# Altium schematic sheet Full-Bridge Converter.SchDoc: Schematic
size A3; DocumentNumber: 1; SheetNumber: 1; SheetTotal: 2
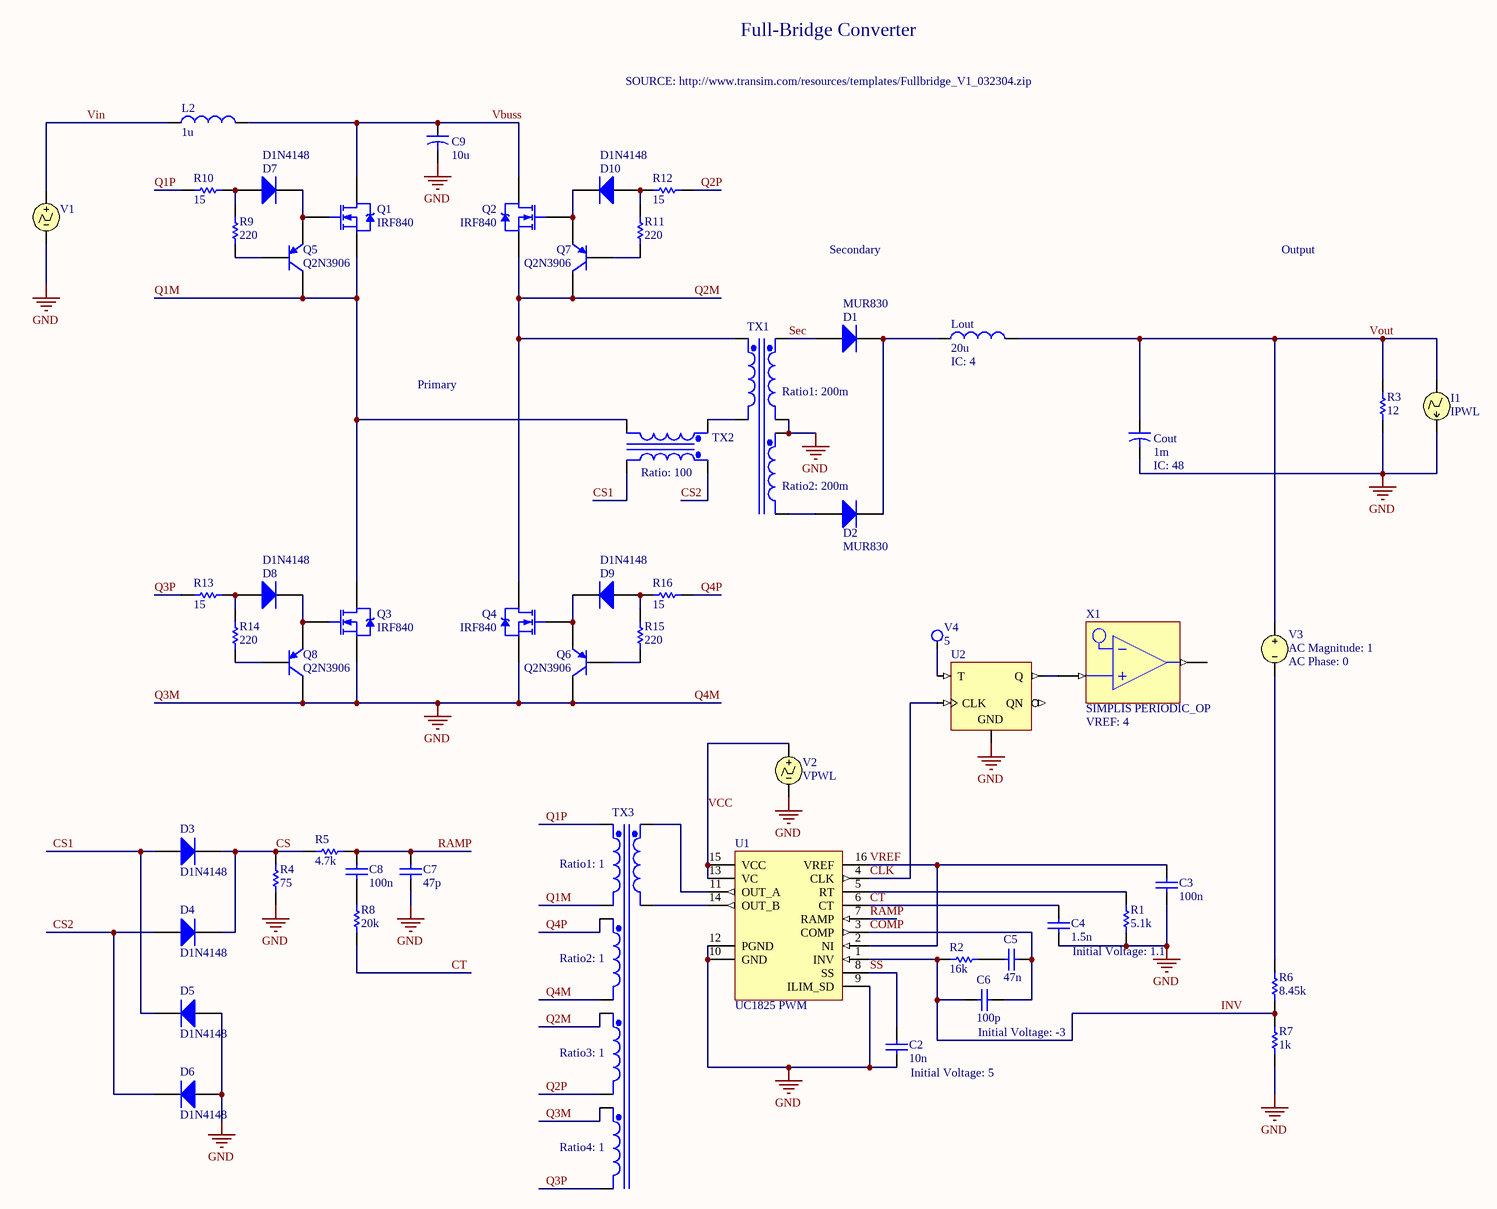
[diagram p0: Full-Bridge Converter.SchDoc]

## Parts
C2  value 10n  Initial Voltage: 5  [RAD-0.3]  (hidden comment: Cap)
C3  value 100n  [RAD-0.3]  (hidden comment: Cap)
C4  value 1.5n  Initial Voltage: 1.1  [RAD-0.3]  (hidden comment: Cap)
C5  value 47n  [RAD-0.3]  (hidden comment: Cap)
C6  value 100p  Initial Voltage: -3  [RAD-0.3]  (hidden comment: Cap)
C7  value 47p  [RAD-0.3]  (hidden comment: Cap)
C8  value 100n  [RAD-0.3]  (hidden comment: Cap)
C9  CC: 10u  [CAPR5-4X5]  (hidden comment: Cap Elec (L1-3))
Cout  IC: 48  CC: 1m  [CAPR5-4X5]  (hidden comment: Cap Elec (L1-3))
D1  MUR830  [SMC]
D2  MUR830  [SMC]
D3  D1N4148  [DO-35]
D4  D1N4148  [DO-35]
D5  D1N4148  [DO-35]
D6  D1N4148  [DO-35]
D7  D1N4148  [DO-35]
D8  D1N4148  [DO-35]
D9  D1N4148  [DO-35]
D10  D1N4148  [DO-35]
I1  IPWL  [HDR1X2H]
L2  value 1u  [0402-A]  (hidden comment: Lossy Inductor)
Lout  value 20u  IC: 4  [0402-A]  (hidden comment: Lossy Inductor)
Q1  IRF840  [TO-220AB]
Q2  IRF840  [TO-220AB]
Q3  IRF840  [TO-220AB]
Q4  IRF840  [TO-220AB]
Q5  Q2N3906  [TO-92A]
Q6  Q2N3906  [TO-92A]
Q7  Q2N3906  [TO-92A]
Q8  Q2N3906  [TO-92A]
R1  value 5.1k  [AXIAL-0.3]  (hidden comment: Res1)
R2  value 16k  [AXIAL-0.3]  (hidden comment: Res1)
R3  value 12  [AXIAL-0.3]  (hidden comment: Res1)
R4  value 75  [AXIAL-0.3]  (hidden comment: Res1)
R5  value 4.7k  [AXIAL-0.3]  (hidden comment: Res1)
R6  value 8.45k  [AXIAL-0.3]  (hidden comment: Res1)
R7  value 1k  [AXIAL-0.3]  (hidden comment: Res1)
R8  value 20k  [AXIAL-0.3]  (hidden comment: Res1)
R9  value 220  [AXIAL-0.3]  (hidden comment: Res1)
R10  value 15  [AXIAL-0.3]  (hidden comment: Res1)
R11  value 220  [AXIAL-0.3]  (hidden comment: Res1)
R12  value 15  [AXIAL-0.3]  (hidden comment: Res1)
R13  value 15  [AXIAL-0.3]  (hidden comment: Res1)
R14  value 220  [AXIAL-0.3]  (hidden comment: Res1)
R15  value 220  [AXIAL-0.3]  (hidden comment: Res1)
R16  value 15  [AXIAL-0.3]  (hidden comment: Res1)
TX1  Ratio1: 200m  [TRF_6]  (hidden comment: Trans3 Simpl)
TX2  Ratio: 100  [TRF_4]  (hidden comment: Trans Simpl)
TX3  Ratio1: 1  [TRF_10]  (hidden comment: Trans5 Simpl)
U1  UC1825 PWM
U2  SIMPLIS CLK_TFF  (value not drawn)
V1  VPWL  [HDR1X2H]  (value not drawn)
V2  VPWL  [HDR1X2H]
V3  AC Magnitude: 1  AC Phase: 0  (hidden comment: VSRC)
V4  value 5  (hidden comment: VSRC2)
X1  SIMPLIS PERIODIC_OP  VREF: 4

## Nets
Q3M: C2.2 C3.2 C4.2 C7.2 C9.2 Cout.2 D5.1(A) D6.1(A) I1.2 Q3.3(S) Q4.3(S) Q6.3(C) Q8.3(C) R1.2 R3.2 R4.2 R7.2 TX1.4(Sec1-) TX1.5(Sec2+) TX3.6(Sec2-) TX3.9(Sec4+) U1.9(ILIM_SD) U1.10(GND) U1.12(PGND) U2.100(GND) V1.2 V2.2  [also labelled GND, Q4M]
CLK: U1.4(CLK) U2.191(CLK)
COMP: C5.1 C6.1 U1.3(COMP)
CS: D3.2(K) D4.2(K) R4.1 R5.1
CS1: D3.1(A) D5.2(K) TX2.4(Sec-)
CS2: D4.1(A) D6.2(K) TX2.3(Sec+)
CT: C4.1 R8.2 U1.6(CT)
INV: C6.2 R2.2 R6.2 R7.1 U1.1(INV)
Q1M: Q1.3(S) Q3.2(D) Q5.3(C) TX2.2(Pri-) TX3.4(Sec1-)
Q1P: R10.1 TX3.3(Sec1+)
Q2M: Q2.3(S) Q4.2(D) Q7.3(C) TX1.1(Pri+) TX3.7(Sec3+)
Q2P: R12.2 TX3.8(Sec3-)
Q3P: R13.1 TX3.10(Sec4-)
Q4P: R16.2 TX3.5(Sec2+)
RAMP: C7.1 C8.1 R5.2 U1.7(RAMP)
Sec: D1.1(A) TX1.3(Sec1+)
SS: C2.1 U1.8(SS)
Vbuss: C9.1 L2.2 Q1.2(D) Q2.2(D)
VCC: U1.13(VC) U1.15(VCC) V2.1
Vin: L2.1 V1.1
Vout: Cout.1 I1.1 Lout.2 R3.1 V3.1
VREF: C3.1 U1.2(NI) U1.16(VREF)
NetC5_2: C5.2 R2.1
NetC8_2: C8.2 R8.1
NetD1_2: D1.2(K) D2.2(K) Lout.1
NetD2_1: D2.1(A) TX1.6(Sec2-)
NetD7_1: D7.1(A) R9.1 R10.2
NetD7_2: D7.2(K) Q1.1(G) Q5.1(E)
NetD8_1: D8.1(A) R13.2 R14.1
NetD8_2: D8.2(K) Q3.1(G) Q8.1(E)
NetD9_1: D9.1(A) R15.1 R16.1
NetD9_2: D9.2(K) Q4.1(G) Q6.1(E)
NetD10_1: D10.1(A) R11.1 R12.1
NetD10_2: D10.2(K) Q2.1(G) Q7.1(E)
NetQ5_2: Q5.2(B) R9.2
NetQ6_2: Q6.2(B) R15.2
NetQ7_2: Q7.2(B) R11.2
NetQ8_2: Q8.2(B) R14.2
NetR1_1: R1.1 U1.5(RT)
NetR6_1: R6.1 V3.2
NetTX1_2: TX1.2(Pri-) TX2.1(Pri+)
NetTX3_1: TX3.1(Pri+) U1.11(OUT_A)
NetTX3_2: TX3.2(Pri-) U1.14(OUT_B)
NetU2_101: U2.101(T) V4.1
NetU2_201: U2.201(Q) X1.1(IN)

Not connected (* = marked no-connect by the designer): U2 202(QN); X1 3(OUT)

## Notes on the sheet
- Full-Bridge Converter
- SOURCE: http://www.transim.com/resources/templates/Fullbridge_V1_032304.zip
- Secondary
- Output
- Primary
- Sheet Title
- Project Title
- Size:
- Date:
- A3
- Number:
- Time:
- Revision:
- Sheet
- of
- File:

## Library data of the parts
C2-C8 = Cap: Capacitor; Published: 8-Jun-2000; LatestRevisionDate: 17-Jul-2002; LatestRevisionNote: Re-released for DXP Platform.; PackageReference: RAD-0.3; Publisher: Altium Limited
C9 Cout = Cap Elec (L1-3): Electrolytic Capacitor (Levels 1-3); LEVEL: 1; RSH_CC: 1Meg; Published: 23-Sep-2002; PackageReference: CAPR5-4X5; Publisher: Altium Limited
  Cout: USEIC: 1
D1 D2 = MUR830: General Purpose Fast Rectifier; PackageReference: TO-220AC
D3-D10 = D1N4148: High Conductance Fast Diode; Published: 8-Jun-2000; LatestRevisionDate: 17-Jul-2002; LatestRevisionNote: Re-released for DXP Platform.; DatasheetDocument: 1997; PackageReference: DO-35; Publisher: Altium Limited; Code_JEDEC: DO-204-AH; ComponentLink1Description: Manufacturer Link; ComponentLink1URL: http://www.fairchildsemi.com/; ComponentLink2Description: Datasheet; ComponentLink2URL: http://www.fairchildsemi.com/ds/1N%2F1N4148.pdf
I1 = IPWL: Piecewise Linear Current Source; Sim Note: To add model file containing time-current pairs of values, enter model location under "General Tab" in "Full Path" box.; Time-Value Pairs: 20u 0 20u 0 30u 10; Published: 8-Jun-2000; LatestRevisionDate: 17-Jul-2002; LatestRevisionNote: Re-released for DXP Platform.; PackageReference: Not Applicable; Publisher: Altium Limited
L2 = Inductor (Lossy): Code_IEC: 1005; RSERIES: 100m; RSHUNT: 1Meg; Published: 8-Jun-2000; LatestRevisionDate: 17-Jul-2002; LatestRevisionNote: Re-released for DXP Platform.; PackageReference: 0402-A; Publisher: Altium Limited; Code_JEITA: 0402
Lout = Inductor (Lossy): Code_IEC: 1005; USEIC: 1; RSERIES: 10m; RSHUNT: 1Meg; Published: 8-Jun-2000; LatestRevisionDate: 17-Jul-2002; LatestRevisionNote: Re-released for DXP Platform.; PackageReference: 0402-A; Publisher: Altium Limited; Code_JEITA: 0402
Q1-Q4 = IRF840: HEXFET N-Channel Power MOSFET; Note: Pin 2 is electrically connected to pin 4.; Published: 8-Jun-2000; LatestRevisionDate: 17-Jul-2002; LatestRevisionNote: Re-released for DXP Platform.; DatasheetVersion: PD-9.376H; PackageVersion: Feb-1997; PackageReference: TO-220AB; Publisher: Altium Limited; PackageDescription: TO, Thru-Hole, Vertical, Heatsink Mounted; 3 In-Line Leads; Pitch 2.54 mm; ComponentLink1Description: Manufacturer Link; ComponentLink1URL: http://www.irf.com/; ComponentLink2Description: Datasheet; ComponentLink2URL: http://www.irf.com/product-info/datasheets/data/irf840.pdf
Q5-Q8 = Q2N3906: PNP General Purpose Amplifier; Published: 8-Jun-2000; LatestRevisionDate: 15-Jan-2003; LatestRevisionNote: PCB Footprint 'BCY-W3/D4.7' replaced; DatasheetDocument: 1997; PackageDocument: Sep-1998; PackageReference: TO-92A; Publisher: Altium Limited; Code_JEDEC: TO-92A; ComponentLink1Description: Manufacturer Link; ComponentLink1URL: http://www.fairchildsemi.com/; ComponentLink2Description: Datasheet; ComponentLink2URL: http://www.fairchildsemi.com/ds/2N%2F2N3906.pdf
R1-R16 = Res1: Resistor; Published: 8-Jun-2000; LatestRevisionDate: 17-Jul-2002; LatestRevisionNote: Re-released for DXP Platform.; PackageReference: AXIAL-0.3; Publisher: Altium Limited
TX1 = Trans3 Simpl: Three-winding Transformer (Simplified Model); Sim Note: Enter the turns ratios, Core loss resistance, Magnetising Reactance, Leakage Reactances and Resistances referred to the primary side into the parameter fields.; L1: 10m; Published: 25-Jan-2001; LatestRevisionDate: 17-Jul-2002; LatestRevisionNote: Re-released for DXP Platform.; PackageReference: TRF_6; Publisher: Altium Limited; Ratio2: 200m
TX2 = Trans Simpl: Transformer (Simplified Model); Published: 8-Jun-2000; LatestRevisionDate: 17-Jul-2002; LatestRevisionNote: Re-released for DXP Platform.; PackageReference: TRF_4; Publisher: Altium Limited
TX3 = Trans5 Simpl: Five-winding Transformer (Simplified Model); L1: 1m; Published: 25-Jan-2001; LatestRevisionDate: 17-Jul-2002; LatestRevisionNote: Re-released for DXP Platform.; PackageReference: TRF_8; Publisher: Altium Limited; Ratio2: 1; Ratio3: 1; Ratio4: 1
U1 = UC1825: High-Speed PWM Controller
U2 = SIMPLIS CLK_TFF: Toggle Flip-Flop; SubClass: T; ClockTrigger: Rising; Enable: High; Reset: Asynchronous; FunctionalClass: Flip-Flop
V1 = VPWL: Piecewise Linear Voltage Source; Note: PCB Footprint - Not required; Sim Note: To add model file containing time-current pairs of values, enter model location under "General Tab" in "Full Path" box.; Time-Value Pairs: 0 400 0 400 10u 400; Published: 8-Jun-2000; LatestRevisionDate: 17-Jul-2002; LatestRevisionNote: Re-released for DXP Platform.; PackageReference: Not Applicable; Publisher: Altium Limited
V2 = VPWL: Piecewise Linear Voltage Source; Note: PCB Footprint - Not required; Sim Note: To add model file containing time-current pairs of values, enter model location under "General Tab" in "Full Path" box.; Time-Value Pairs: 1p 12 1p 12 1p 12; Published: 8-Jun-2000; LatestRevisionDate: 17-Jul-2002; LatestRevisionNote: Re-released for DXP Platform.; PackageReference: Not Applicable; Publisher: Altium Limited
V3 = VSRC: Voltage Source; Note: PCB Footprint - Not required; Value: 0; Published: 8-Jun-2000; LatestRevisionDate: 17-Jul-2002; LatestRevisionNote: Re-released for DXP Platform.; PackageReference: Not Applicable; Publisher: Altium Limited
V4 = VSRC2: Voltage Source; Note: PCB Footprint - Not required; Published: 8-Jun-2000; LatestRevisionDate: 17-Jul-2002; LatestRevisionNote: Re-released for DXP Platform.; PackageReference: Not Applicable; Publisher: Altium Limited
X1 = SIMPLIS PERIODIC_OP: Periodic Operating Point Analysis Trigger; XilinxEquivalent: XNOR2; FunctionalClass: Logic Primitive; SubClass: XNOR; PortSize: 2; PortStyle: Single Pin Version; ArchiveName: GENERIC; VHDLIB_SIM: GENERIC_LIB; Published: 29-Jan-2004; Publisher: Altium Limited; LastRevisionNo: 1.00.00; HelpURL: CR0118 FPGA Generic Library Guide.pdf#page=445; ComponentLink1URL: CR0136 FPGA Logic Primitive Resource Usage.pdf#page=252; ComponentLink1Description: Core &Resource Usage